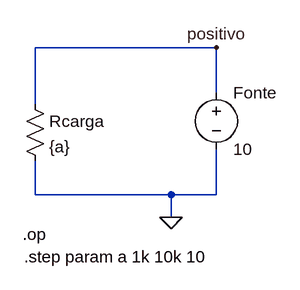
[diagram p0: schematic Draft1.asc]
Draft1.asc, the LTspice schematic file:
Version 4
SHEET 1 880 680
WIRE 384 32 128 32
WIRE 384 96 384 32
WIRE 128 112 128 32
WIRE 128 240 128 192
WIRE 320 240 128 240
WIRE 384 240 384 176
WIRE 384 240 320 240
WIRE 320 272 320 240
FLAG 320 272 0
FLAG 384 32 positivo
SYMBOL res 112 96 R0
SYMATTR InstName Rcarga
SYMATTR Value {a}
SYMBOL voltage 384 80 R0
WINDOW 123 0 0 Left 0
WINDOW 39 0 0 Left 0
SYMATTR InstName Fonte
SYMATTR Value 10
TEXT 110 296 Left 2 !.op
TEXT 112 328 Left 2 !.step param a 1k 10k 10

The netlist it stands for:
* Draft1.asc
Rcarga positivo 0 {a}
V§Fonte positivo 0 10
.op
.step param a 1k 10k 10
.backanno
.end

* Results of the author's LTspice run, read from the files saved beside the schematic
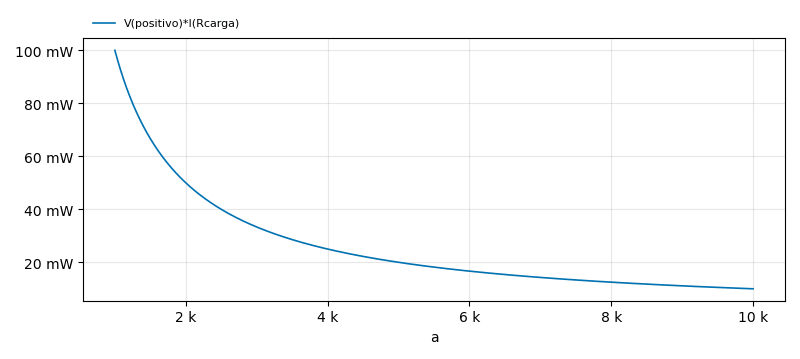
[diagram p1: Operating Point of Draft1.asc, plotted from the saved traces]
* Operating Point, 1 run:
*   V(positivo)*I(Rcarga): 100 mW at a=1 k, 10 mW at a=10 k, min 10 mW, max 100 mW